# Altium schematic sheet 7_HDMI.schdoc
size 210 x 148 mm; Symbol: tv_muban1_1; Company: 嘉立创EDA; Version: V1.0; Page Size: A4; @Project Name: LCEDAsucaiku; @Update Date: 2026-05-01; @Create Date: 2026-03-27; @Page Name: HDMI; @Page Count: 8; @Page No: 7; @Update Time: 18:54:36; Color: #990000; Device: sucai_muban; @Board Name: tv基板; @Create Time: 22:35:45; @Schematic Name: Schematic1; @Assembly Variant: Basic; Border: 1; Title Block Position: 3; Size: A4; Width: 826; Height: 582; Region Start: 1; X Region Count: 6; Y Region Count: 4; Blade Width: 10; SheetNumber: 7; SheetTotal: 7
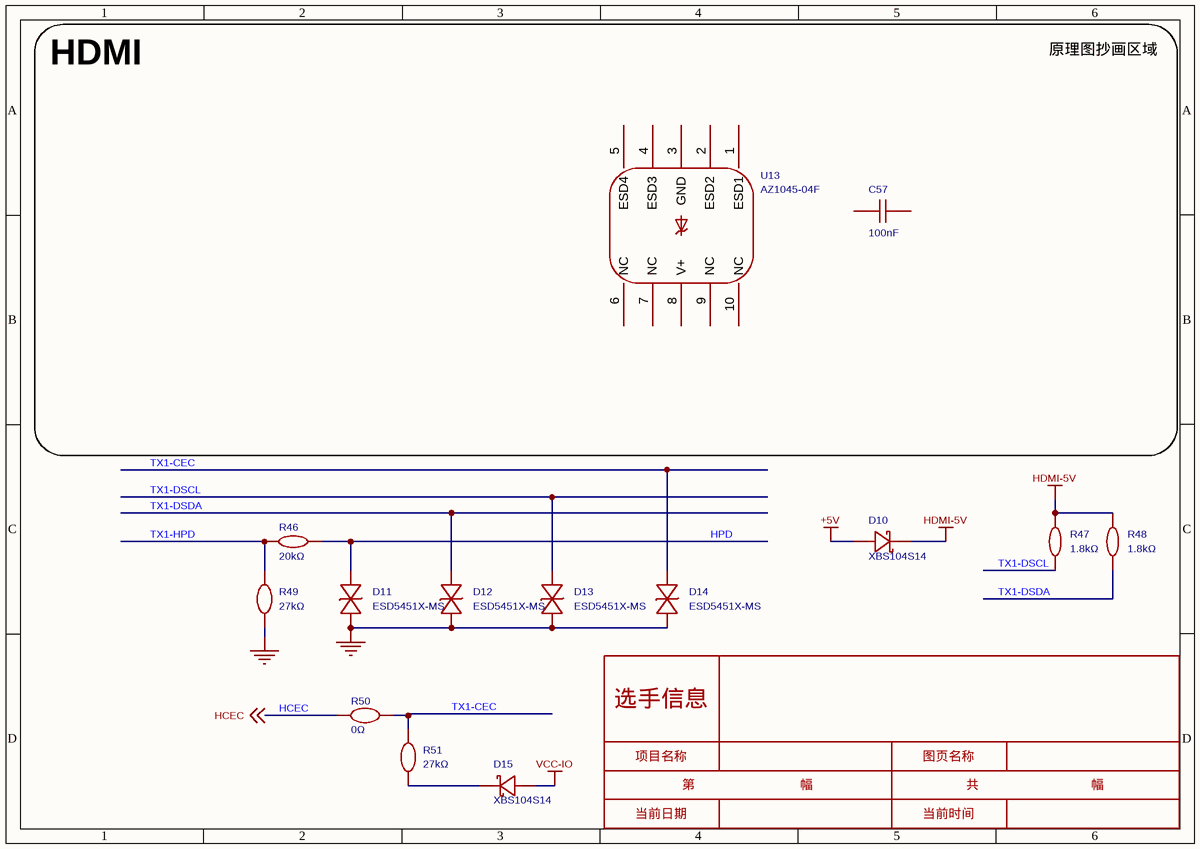
[diagram p0: 7_HDMI.schdoc]

## Parts
C57  100nF  [C0402]
D10  XBS104S14  [SOD-123FL_L2.8-W1.8-LS3.7-RD]
D11  ESD5451X-MS  [DFN1006-2L-BI]
D12  ESD5451X-MS  [DFN1006-2L-BI]
D13  ESD5451X-MS  [DFN1006-2L-BI]
D14  ESD5451X-MS  [DFN1006-2L-BI]
D15  XBS104S14  [SOD-123FL_L2.8-W1.8-LS3.7-RD]
R46  20kΩ  [R0402]
R47  1.8kΩ  [R0402]
R48  1.8kΩ  [R0402]
R49  27kΩ  [R0402]
R50  0Ω  [R0402]
R51  27kΩ  [R0402]
U13  AZ1045-04F  [DFN2510-10_L2.5-W1.0-P0.50-BL]

## Blocks framed on the sheet
HDMI: C57 U13

## Nets
+5V: D10.2(A)
GND: D11.1 D12.1 D13.1 D14.1 R49.1
HDMI-5V: D10.1(K) R47.2 R48.2
VCC-IO: D15.2(A)
HCEC: R50.1 ; off-sheet HCEC
HPD: D11.2 R46.2
TX1-CEC: D14.2 R50.2 R51.2
TX1-DSCL: D13.2 R47.1
TX1-DSDA: D12.2 R48.1
TX1-HPD: R46.1 R49.2
NetD15_1: D15.1(K) R51.1

Not connected (* = marked no-connect by the designer): C57 1 2; U13 1(ESD1) 2(ESD2) 3(GND) 4(ESD3) 5(ESD4) 6(NC) 7(NC) 8(V+) 9(NC) 10(NC)

## Notes on the sheet
- 原理图抄画区域
- 选手信息
- 项目名称
- 第                              幅
- 图页名称
- 共                                幅
- 当前日期
- 当前时间

## Library data of the parts
C57 = CL05B104KO5NNNC: 容值:100nF;精度:±10%;额定电压:16V;温度系数:X7R;; Manufacturer: SAMSUNG(三星); 3D Model: 36a51122f27c49738f86b3bfa98863e0聨0819f05c4eef4c71ace90d822a990e87; 3D Model Transform: 39.37,19.685,0,0,0,0,0,0,0; Tolerance: ±10%; Voltage Rating: 16V; Temperature Coefficient: X7R; AddInBom: yes; ModelName: C0402_L1.0-W0.5-H0.5; Symbol: CL05B104KO5NNNC; Device: CL05B104KO5NNNC; LCSC Part Name: 100nF ±10% 16V; Supplier Part: C1525; Manufacturer Part: CL05B104KO5NNNC; Supplier Footprint: 0402; JLCPCB Part Class: Basic Part; Datasheet: https://item.szlcsc.com/datasheet/CL05B104KO5NNNC/1877.html; Supplier: LCSC; Value: 100nF; ConvertToPcb: yes; FootprintName: C0402
D10 D15 = XBS104S14: 二极管配置:独立式;正向压降(Vf):490mV@1A;直流反向耐压(Vr):40V;整流电流:1A;; Manufacturer: Slkor(萨科微); 3D Model: b8c4b3388b3d4c198b22b876116f592b聨0819f05c4eef4c71ace90d822a990e87; 3D Model Transform: 145.669,70.866,0,0,0,0,0,0,0; Diode Configuration: 独立式; Voltage - DC Reverse(Vr): 40V; Current - Rectified: 1A; Reverse Leakage Current (Ir): 4uA@40V; Non-Repetitive Peak Forward Surge Current: 10A; AddInBom: yes; Symbol: XBS104S14; Device: XBS104S14; LCSC Part Name: 电压:40V 电流:1A; Supplier Part: C5185949; Manufacturer Part: XBS104S14; Supplier Footprint: SOD-123FL; JLCPCB Part Class: Extended Part; Datasheet: https://item.szlcsc.com/datasheet/XBS104S14/5856509.html; Supplier: LCSC; Voltage - Forward(Vf@If): 490mV@1A; ConvertToPcb: yes; FootprintName: SOD-123FL_L2.8-W1.8-LS3.7-RD; ModelName: SOD-123FL_L2.8-W1.8-LS3.7-RD
D11-D14 = ESD5451X-MS: 反向截止电压(Vrwm):5V;峰值脉冲电流(Ipp):8A;击穿电压:5.6V;; Manufacturer: MSKSEMI(美森科); AddInBom: yes; ModelId: 2bdbcca3b35b49c5a8ae725a08658930聨0819f05c4eef4c71ace90d822a990e87; ModelTransform: 40.1574,24.4094,0,0,0,0,0,0,0; Reverse Stand-Off Voltage (Vrwm): 5V; Peak Pulse Current (Ipp): 8A; Breakdown Voltage: 5.6V; Type: ESD; Symbol: ESD5451X-MS; Device: ESD5451X-MS; LCSC Part Name: 丝印C; SupplierPart: C7379960; ManufacturerPart: ESD5451X-MS; Supplier Footprint: DFN1006-2L; JLCPCB Part Class: Extended Part; Datasheet: https://atta.szlcsc.com/upload/public/pdf/source/20230621/69F6BD434835CFDE06A31A18B4149936.pdf; Supplier: LCSC; ConvertToPcb: yes; FootprintName: DFN1006-2L-BI; ModelName: DFN1006-2L-BI
R46 = FRC0402F2002TS: 电阻类型:厚膜电阻;阻值:20kΩ;精度:±1%;功率:62.5mW;工作电压:50V;温度系数:±100ppm/℃;; Manufacturer: FOJAN(富捷); 3D Model: 98c88bc2b9094f218f3a3e30a7012738聨0819f05c4eef4c71ace90d822a990e87; 3D Model Transform: 39.37,19.685,0,0,0,0,0,0,0; Tolerance: ±1%; Power(Watts): 62.5mW; Voltage-Supply(Max): 50V; AddInBom: yes; ModelName: R0402_L1.0-W0.5-H0.4; Symbol: FRC0402F2002TS; Device: FRC0402F2002TS; LCSC Part Name: 20kΩ ±1% 62.5mW 厚膜电阻; Supplier Part: C2906867; Manufacturer Part: FRC0402F2002TS; Supplier Footprint: 0402; JLCPCB Part Class: Extended Part; Datasheet: https://item.szlcsc.com/datasheet/FRC0402F2002TS/3180380.html; Supplier: LCSC; Type: 厚膜电阻; Value: 20kΩ; Temperature Coefficient: ±100ppm/℃; Operating Temperature: -55℃~+155℃; ConvertToPcb: yes; FootprintName: R0402
R47 R48 = 0402WGF1801TCE: 电阻类型:厚膜电阻;阻值:1.8kΩ;精度:±1%;功率:62.5mW;工作电压:50V;温度系数:±100ppm/℃;; Manufacturer: UNI-ROYAL(厚声); 3D Model: 98c88bc2b9094f218f3a3e30a7012738聨0819f05c4eef4c71ace90d822a990e87; 3D Model Transform: 39.37,19.685,0,0,0,0,0,0,0; Tolerance: ±1%; Power(Watts): 62.5mW; Voltage-Supply(Max): 50V; AddInBom: yes; ModelName: R0402_L1.0-W0.5-H0.4; Symbol: 0402WGF1801TCE; Device: 0402WGF1801TCE; LCSC Part Name: 1.8kΩ ±1% 62.5mW 厚膜电阻; Supplier Part: C25871; Manufacturer Part: 0402WGF1801TCE; Supplier Footprint: 0402; JLCPCB Part Class: Extended Part; Datasheet: https://item.szlcsc.com/datasheet/0402WGF1801TCE/26614.html; Supplier: LCSC; Type: 厚膜电阻; Value: 1.8kΩ; Temperature Coefficient: ±100ppm/℃; Operating Temperature: -55℃~+155℃; ConvertToPcb: yes; FootprintName: R0402
R49 R51 = FRC0402F2702TS: 电阻类型:厚膜电阻;阻值:27kΩ;精度:±1%;功率:62.5mW;工作电压:50V;温度系数:±100ppm/℃;; Manufacturer: FOJAN(富捷); 3D Model: 98c88bc2b9094f218f3a3e30a7012738聨0819f05c4eef4c71ace90d822a990e87; 3D Model Transform: 39.37,19.685,0,0,0,0,0,0,0; Tolerance: ±1%; Power(Watts): 62.5mW; Voltage-Supply(Max): 50V; AddInBom: yes; ModelName: R0402_L1.0-W0.5-H0.4; Symbol: FRC0402F2702TS; Device: FRC0402F2702TS; LCSC Part Name: 27kΩ ±1% 62.5mW 厚膜电阻; Supplier Part: C2933084; Manufacturer Part: FRC0402F2702TS; Supplier Footprint: 0402; JLCPCB Part Class: Extended Part; Supplier: LCSC; Type: 厚膜电阻; Value: 27kΩ; Temperature Coefficient: ±100ppm/℃; Operating Temperature: -55℃~+155℃; ConvertToPcb: yes; FootprintName: R0402
R50 = FRC0402P000 TS: 电阻类型:厚膜电阻;阻值:0Ω;精度:±5%;功率:62.5mW;工作电压:50V;; Manufacturer: FOJAN(富捷); 3D Model: 98c88bc2b9094f218f3a3e30a7012738聨0819f05c4eef4c71ace90d822a990e87; 3D Model Transform: 39.37,19.685,0,0,0,0,0,0,0; Tolerance: ±5%; Power(Watts): 62.5mW; Voltage-Supply(Max): 50V; AddInBom: yes; ModelName: R0402_L1.0-W0.5-H0.4; Symbol: FRC0402P000 TS; Device: FRC0402P000 TS; LCSC Part Name: 0Ω ±5% 62.5mW 厚膜电阻; Supplier Part: C2906877; Manufacturer Part: FRC0402P000 TS; Supplier Footprint: 0402; JLCPCB Part Class: Extended Part; Supplier: LCSC; Type: 厚膜电阻; Value: 0Ω; Operating Temperature: -55℃~+155℃; ConvertToPcb: yes; FootprintName: R0402
U13 = AZ1045-04F: Relevance: []; componentDisplayMode: -1; AddInBom: yes; OriginFootprint: DFN-10_2r50x1r00-H0r53-P0r50_B; Symbol: AZ1045-04F; Device: AZ1045-04F; FootprintName: DFN2510-10_L2.5-W1.0-P0.50-BL; ConvertToPcb: yes